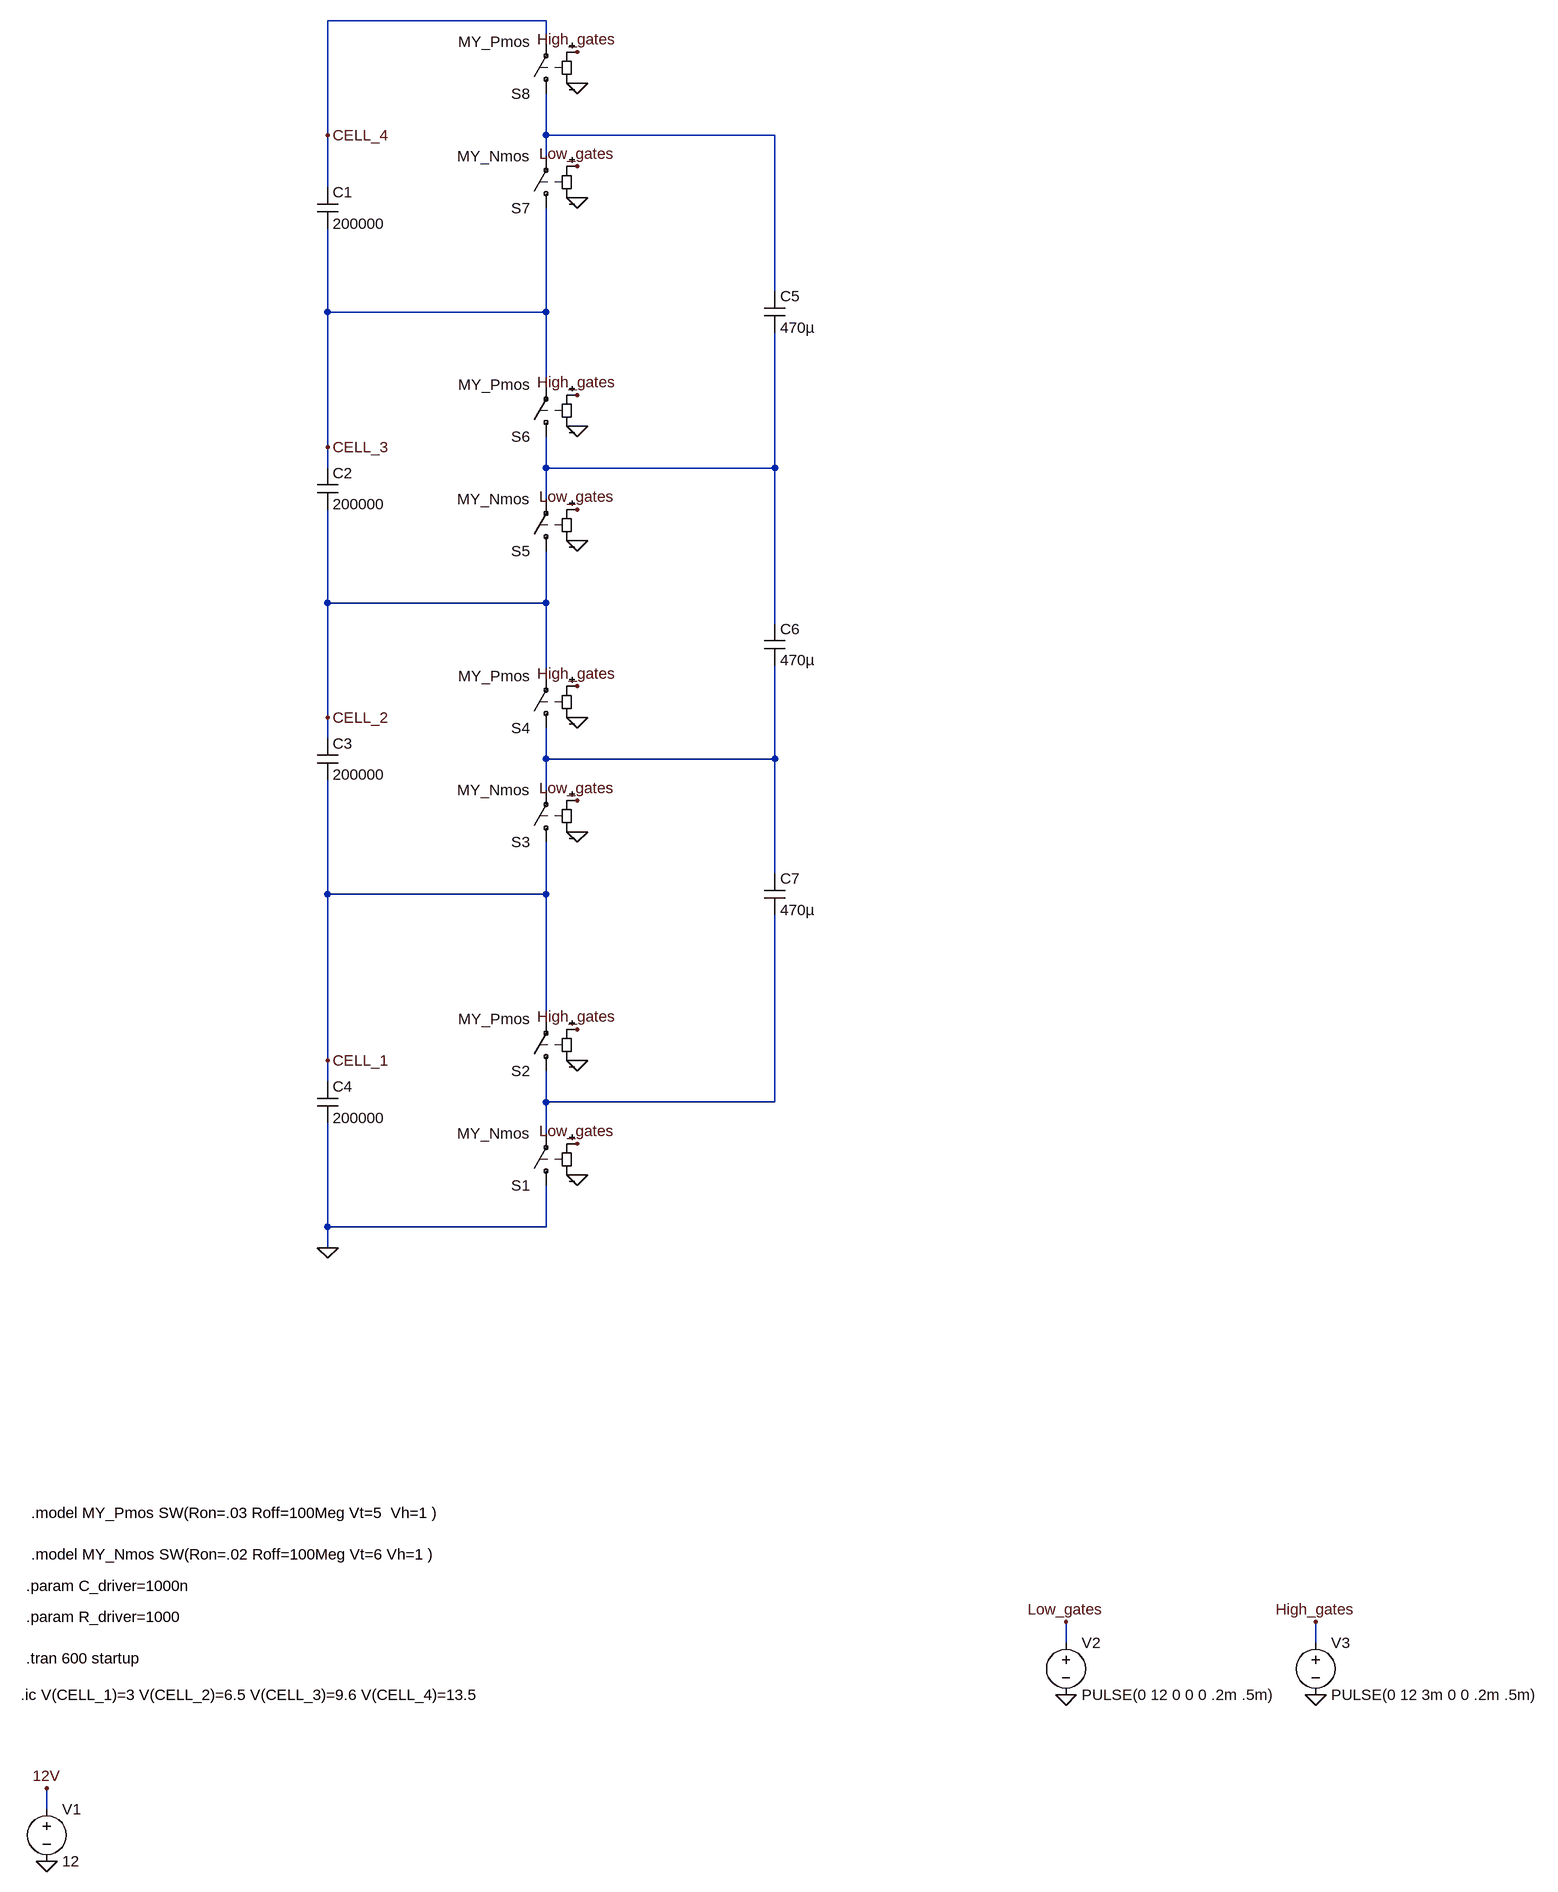
[diagram p0: schematic BMS_balancer2.asc]
BMS_balancer2.asc, the LTspice schematic file:
Version 4
SHEET 1 4336 2692
WIRE 736 -160 400 -160
WIRE 736 -128 736 -160
WIRE 400 16 400 -160
WIRE 736 16 736 -48
WIRE 1088 16 736 16
WIRE 736 48 736 16
WIRE 400 96 400 16
WIRE 1088 256 1088 16
WIRE 400 288 400 160
WIRE 736 288 736 128
WIRE 736 288 400 288
WIRE 736 400 736 288
WIRE 400 496 400 288
WIRE 400 528 400 496
WIRE 736 528 736 480
WIRE 1088 528 1088 320
WIRE 1088 528 736 528
WIRE 736 576 736 528
WIRE 400 736 400 592
WIRE 736 736 736 656
WIRE 736 736 400 736
WIRE 1088 768 1088 528
WIRE 736 848 736 736
WIRE 400 912 400 736
WIRE 400 944 400 912
WIRE 736 976 736 928
WIRE 1088 976 1088 832
WIRE 1088 976 736 976
WIRE 736 1024 736 976
WIRE 1088 1152 1088 976
WIRE 400 1184 400 1008
WIRE 736 1184 736 1104
WIRE 736 1184 400 1184
WIRE 736 1376 736 1184
WIRE 400 1440 400 1184
WIRE 400 1472 400 1440
WIRE 736 1504 736 1456
WIRE 1088 1504 1088 1216
WIRE 1088 1504 736 1504
WIRE 736 1552 736 1504
WIRE 400 1696 400 1536
WIRE 736 1696 736 1632
WIRE 736 1696 400 1696
WIRE 400 1728 400 1696
WIRE 1536 2336 1536 2304
WIRE 1920 2336 1920 2304
WIRE -32 2592 -32 2560
FLAG 400 1728 0
FLAG 400 1440 CELL_1
FLAG 400 912 CELL_2
FLAG 400 496 CELL_3
FLAG 400 16 CELL_4
FLAG -32 2672 0
FLAG -32 2560 12V
FLAG 1536 2416 0
FLAG 1920 2416 0
FLAG 1920 2304 High_gates
FLAG 1536 2304 Low_gates
FLAG 784 1440 0
FLAG 784 1616 0
FLAG 784 1568 Low_gates
FLAG 784 1392 High_gates
FLAG 784 912 0
FLAG 784 1088 0
FLAG 784 1040 Low_gates
FLAG 784 864 High_gates
FLAG 784 464 0
FLAG 784 640 0
FLAG 784 592 Low_gates
FLAG 784 416 High_gates
FLAG 784 -64 0
FLAG 784 112 0
FLAG 784 64 Low_gates
FLAG 784 -112 High_gates
SYMBOL cap 384 96 R0
SYMATTR InstName C1
SYMATTR Value 200000
SYMATTR SpiceLine Rser=.3
SYMBOL cap 384 528 R0
SYMATTR InstName C2
SYMATTR Value 200000
SYMATTR SpiceLine Rser=.15
SYMBOL cap 384 944 R0
SYMATTR InstName C3
SYMATTR Value 200000
SYMATTR SpiceLine Rser=.23
SYMBOL cap 384 1472 R0
SYMATTR InstName C4
SYMATTR Value 200000
SYMATTR SpiceLine Rser=.19
SYMBOL voltage -32 2576 R0
WINDOW 123 0 0 Left 0
SYMATTR InstName V1
SYMATTR Value 12
SYMATTR SpiceLine Rser=0.01 Cpar=100u
SYMBOL voltage 1536 2320 R0
WINDOW 123 0 0 Left 0
SYMATTR InstName V2
SYMATTR Value PULSE(0 12 0 0 0 .2m .5m)
SYMATTR SpiceLine Rser=0.1
SYMBOL voltage 1920 2320 R0
WINDOW 123 0 0 Left 0
SYMATTR InstName V3
SYMATTR Value PULSE(0 12 3m 0 0 .2m .5m)
SYMATTR SpiceLine Rser=0.1
SYMBOL sw 736 1648 R180
SYMATTR InstName S1
SYMATTR Value MY_Nmos
SYMBOL sw 736 1472 R180
SYMATTR InstName S2
SYMATTR Value MY_Pmos
SYMBOL sw 736 1120 R180
SYMATTR InstName S3
SYMATTR Value MY_Nmos
SYMBOL sw 736 944 R180
SYMATTR InstName S4
SYMATTR Value MY_Pmos
SYMBOL sw 736 672 R180
SYMATTR InstName S5
SYMATTR Value MY_Nmos
SYMBOL sw 736 496 R180
SYMATTR InstName S6
SYMATTR Value MY_Pmos
SYMBOL sw 736 144 R180
SYMATTR InstName S7
SYMATTR Value MY_Nmos
SYMBOL sw 736 -32 R180
SYMATTR InstName S8
SYMATTR Value MY_Pmos
SYMBOL cap 1072 256 R0
SYMATTR InstName C5
SYMATTR Value 470µ
SYMATTR SpiceLine Rser=.2
SYMBOL cap 1072 768 R0
SYMATTR InstName C6
SYMATTR Value 470µ
SYMATTR SpiceLine Rser=.2
SYMBOL cap 1072 1152 R0
SYMATTR InstName C7
SYMATTR Value 470µ
SYMATTR SpiceLine Rser=.2
TEXT -64 2360 Left 2 !.tran 600 startup
TEXT -72 2416 Left 2 !.ic V(CELL_1)=3 V(CELL_2)=6.5 V(CELL_3)=9.6 V(CELL_4)=13.5
TEXT -64 2296 Left 2 !.param R_driver=1000
TEXT -64 2248 Left 2 !.param C_driver=1000n
TEXT -56 2200 Left 2 !.model MY_Nmos SW(Ron=.02 Roff=100Meg Vt=6 Vh=1 )
TEXT -56 2136 Left 2 !.model MY_Pmos SW(Ron=.03 Roff=100Meg Vt=5  Vh=1 )

The netlist it stands for:
* BMS_balancer2.asc
C1 CELL_4 CELL_3 200000 Rser=.3
C2 CELL_3 CELL_2 200000 Rser=.15
C3 CELL_2 CELL_1 200000 Rser=.23
C4 CELL_1 0 200000 Rser=.19
V1 12V 0 12 Rser=0.01 Cpar=100u
V2 Low_gates 0 PULSE(0 12 0 0 0 .2m .5m) Rser=0.1
V3 High_gates 0 PULSE(0 12 3m 0 0 .2m .5m) Rser=0.1
S1 0 N004 Low_gates 0 MY_Nmos
S2 N004 CELL_1 High_gates 0 MY_Pmos
S3 CELL_1 N003 Low_gates 0 MY_Nmos
S4 N003 CELL_2 High_gates 0 MY_Pmos
S5 CELL_2 N002 Low_gates 0 MY_Nmos
S6 N002 CELL_3 High_gates 0 MY_Pmos
S7 CELL_3 N001 Low_gates 0 MY_Nmos
S8 N001 CELL_4 High_gates 0 MY_Pmos
C5 N001 N002 470µ Rser=.2
C6 N002 N003 470µ Rser=.2
C7 N003 N004 470µ Rser=.2
.tran 600 startup
.ic V(CELL_1)=3 V(CELL_2)=6.5 V(CELL_3)=9.6 V(CELL_4)=13.5
.param R_driver=1000
.param C_driver=1000n
.model MY_Nmos SW(Ron=.02 Roff=100Meg Vt=6 Vh=1 )
.model MY_Pmos SW(Ron=.03 Roff=100Meg Vt=5  Vh=1 )
.backanno
.end